# Altium schematic sheet VINYL-Player.SchDoc
size 297 x 209 mm
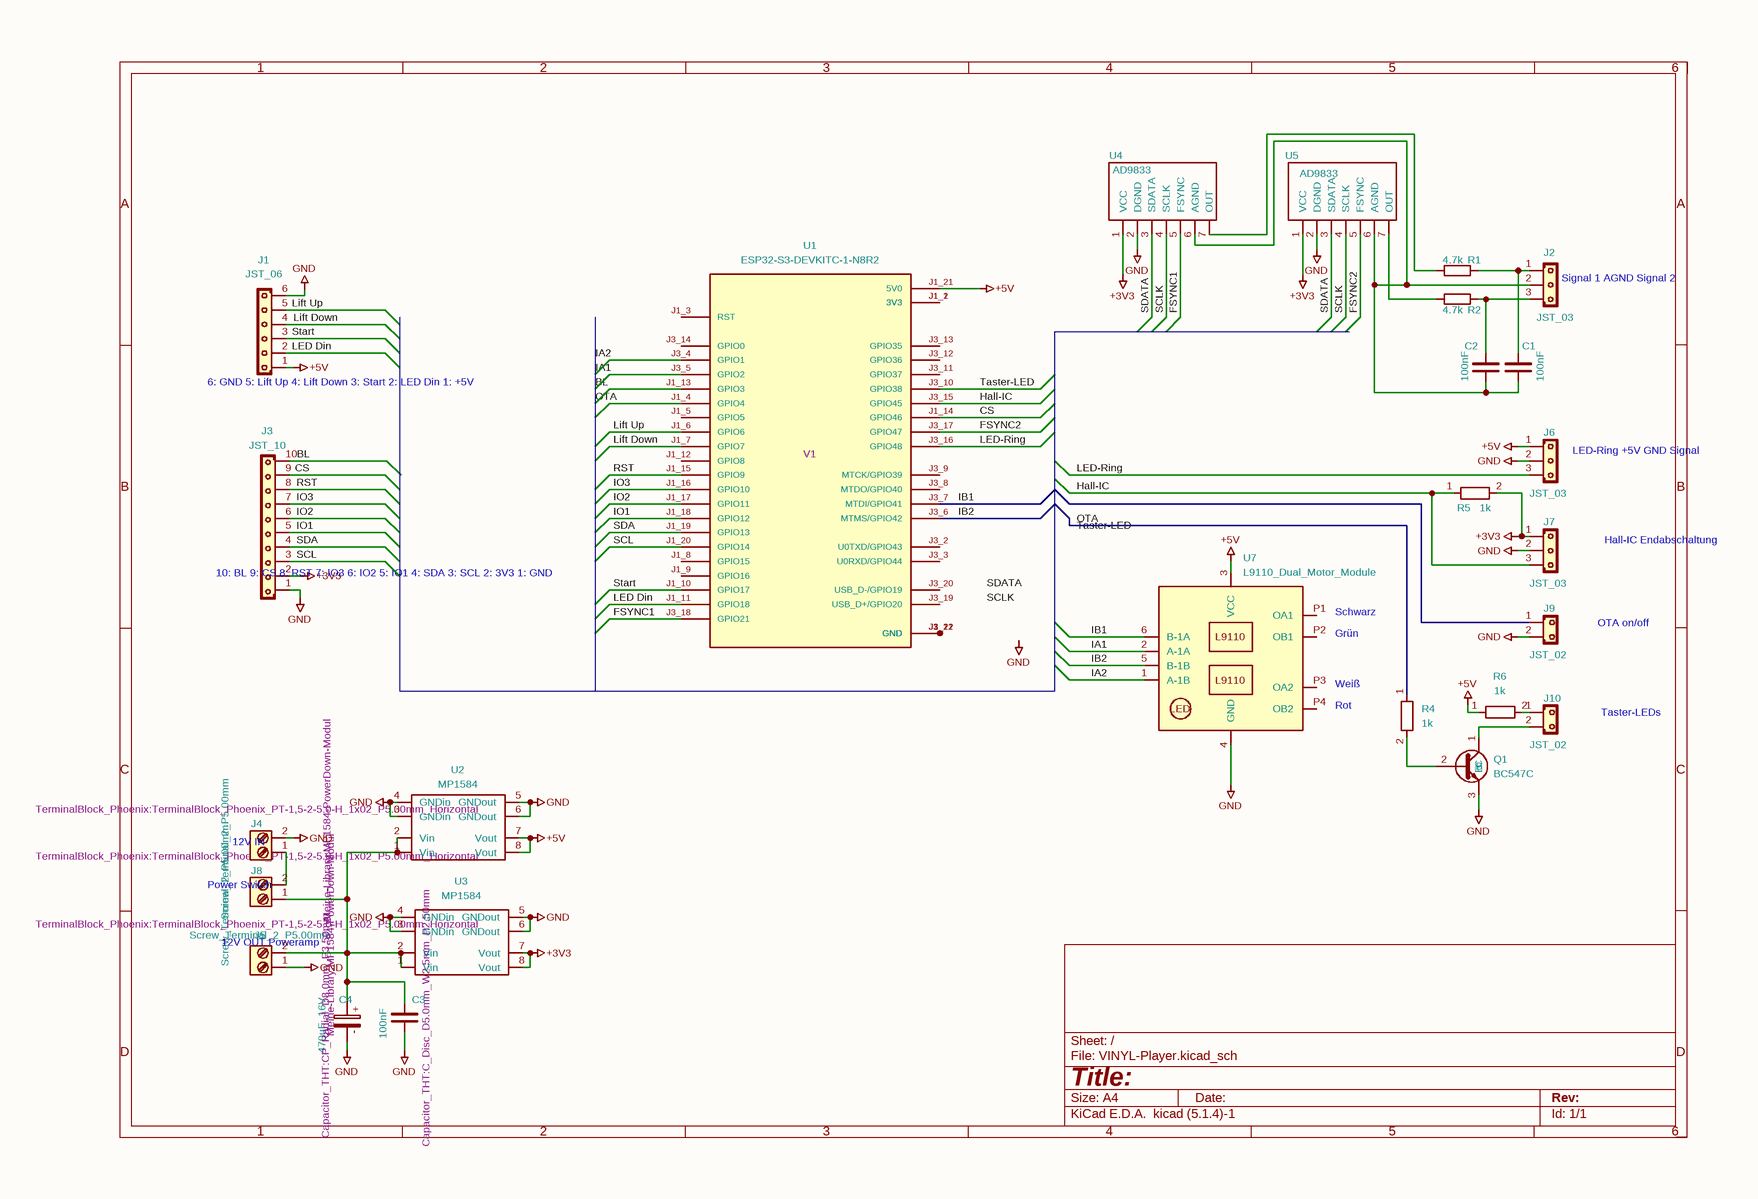
[diagram p0: VINYL-Player.SchDoc]

## Parts
C1  100nF  [C_Disc_D5.0mm_W2.5mm_P2.50mm]
C2  100nF  [C_Disc_D5.0mm_W2.5mm_P2.50mm]
C3  Footprint: Capacitor_THT:C_Disc_D5.0mm_W2.5mm_P2.50mm  [C_Disc_D5.0mm_W2.5mm_P2.50mm]  (hidden comment: 100nF)
C4  Footprint: Capacitor_THT:CP_Radial_D8.0mm_P3.50mm  [CP_Radial_D8.0mm_P3.50mm]  (hidden comment: 470uF_16V)
J1  JST_06  [JST_EH_B6B-EH-A_1x06_P2.50mm_Vertical]
J2  JST_03  [JST_EH_B3B-EH-A_1x03_P2.50mm_Vertical]
J3  JST_10  [JST_EH_B10B-EH-A_1x10_P2.50mm_Vertical]
J4  Footprint: TerminalBlock_Phoenix:TerminalBlock_Phoenix_PT-1,5-2-5.0-H_1x02_P5.00mm_Horizontal  [TerminalBlock_Phoenix_PT-1,5-2-5.0-H_1x02_P5.00mm_Horizontal]  (hidden comment: Screw_Terminal_2_P5.00mm)
J5  Footprint: TerminalBlock_Phoenix:TerminalBlock_Phoenix_PT-1,5-2-5.0-H_1x02_P5.00mm_Horizontal  [TerminalBlock_Phoenix_PT-1,5-2-5.0-H_1x02_P5.00mm_Horizontal]  (hidden comment: Screw_Terminal_2_P5.00mm)
J6  JST_03  [JST_EH_B3B-EH-A_1x03_P2.50mm_Vertical]
J7  JST_03  [JST_EH_B3B-EH-A_1x03_P2.50mm_Vertical]
J8  Footprint: TerminalBlock_Phoenix:TerminalBlock_Phoenix_PT-1,5-2-5.0-H_1x02_P5.00mm_Horizontal  [TerminalBlock_Phoenix_PT-1,5-2-5.0-H_1x02_P5.00mm_Horizontal]  (hidden comment: Screw_Terminal_2_P5.00mm)
J9  JST_02  [JST_EH_B2B-EH-A_1x02_P2.50mm_Vertical]
J10  JST_02  [JST_EH_B2B-EH-A_1x02_P2.50mm_Vertical]
Q1  BC547C  [TO-92_Inline_Wide_CBE]
R1  4.7k  [R_Axial_DIN0207_L6.3mm_D2.5mm_P10.16mm_Horizontal]
R2  4.7k  [R_Axial_DIN0207_L6.3mm_D2.5mm_P10.16mm_Horizontal]
R4  1k  [R_Axial_DIN0204_L3.6mm_D1.6mm_P7.62mm_Horizontal]
R5  1k  [R_Axial_DIN0204_L3.6mm_D1.6mm_P7.62mm_Horizontal]
R6  1k  [R_Axial_DIN0204_L3.6mm_D1.6mm_P7.62mm_Horizontal]
U1  PARTREV: V1  [XCVR_ESP32-S3-DEVKITC-1-N8R2]  (hidden comment: ESP32-S3-DEVKITC-1-N8R2)
U2  Footprint: Meine-Library:MP1584-PowerDown-Modul  [MP1584-PowerDown-Modul]  (hidden comment: MP1584)
U3  Footprint: Meine-Library:MP1584-PowerDown-Modul  [MP1584-PowerDown-Modul]  (hidden comment: MP1584)
U4  AD9833  [AD9833-Modul-Hochkant]
U5  AD9833  [AD9833-Modul-Hochkant]
U7  L9110_Dual_Motor_Module  [L9110_Dual_Motor_Module]

## Nets
+3V3: J3.2 J7.1 R5.2 U3.7(Vout) U3.8(Vout) U4.1(VCC) U5.1(VCC)
+5V: J1.1 J6.1 R6.1 U1.J1_21(5V0) U2.7(Vout) U2.8(Vout) U7.3(VCC)
GND: C3.1 C4.2 J1.6 J3.1 J4.2 J5.1 J6.2 J7.2 J9.2 Q1.3(E) U2.3(GNDin) U2.4(GNDin) U2.5(GNDout) U2.6(GNDout) U3.3(GNDin) U3.4(GNDin) U3.5(GNDout) U3.6(GNDout) U4.2(DGND) U5.2(DGND) U7.4(GND)
BL: J3.10 U1.J3_5(GPIO2)
CS: J3.9 U1.J1_14(GPIO46)
FSYNC1: U1.J3_18(GPIO21) U4.5(FSYNC)
FSYNC2: U1.J3_17(GPIO47) U5.5(FSYNC)
Hall-IC: J7.3 R5.1 U1.J3_15(GPIO45)
IA1: U1.J3_4(GPIO1) U7.2(A-1A)
IA2: U7.1(A-1B)
IB1: U1.J3_7(MTDI/GPIO41) U7.6(B-1A)
IB2: U1.J3_6(MTMS/GPIO42) U7.5(B-1B)
IO1: J3.5 U1.J1_18(GPIO12)
IO2: J3.6 U1.J1_17(GPIO11)
IO3: J3.7 U1.J1_16(GPIO10)
LED Din: J1.2 U1.J1_11(GPIO18)
LED-Ring: J6.3 U1.J3_16(GPIO48)
Lift Down: J1.4 U1.J1_7(GPIO7)
Lift Up: J1.5 U1.J1_6(GPIO6)
OTA: R4.1 U1.J1_13(GPIO3)
RST: J3.8 U1.J1_15(GPIO9)
SCL: J3.3 U1.J1_20(GPIO14)
SCLK: U4.4(SCLK) U5.4(SCLK)
SDA: J3.4 U1.J1_19(GPIO13)
SDATA: U4.3(SDATA) U5.3(SDATA)
Start: J1.3 U1.J1_10(GPIO17)
Taster-LED: U1.J3_10(GPIO38)
NetC1_1: C1.1 C2.1 J2.2 U4.6(AGND) U5.6(AGND)
NetC1_2: C1.2 J2.1 R1.2
NetC2_2: C2.2 J2.3 R2.1
NetC3_2: C3.2 C4.1 J5.2 J8.1 U2.1(Vin) U2.2(Vin) U3.1(Vin) U3.2(Vin)
NetJ4_1: J4.1 J8.2
NetJ10_1: J10.1 R6.2
NetJ10_2: J10.2 Q1.1(C)
NetQ1_2: Q1.2(B) R4.2
NetR1_1: R1.1 U4.7(OUT)
NetR2_2: R2.2 U5.7(OUT)
NetU1_J1_1: U1.J1_1(3V3) U1.J1_2(3V3)
NetU1_J1_22: U1.J1_22(GND) U1.J3_1(GND) U1.J3_21(GND) U1.J3_22(GND)

Not connected (* = marked no-connect by the designer): J9 1; U1 J1_3(RST) J1_4(GPIO4) J1_5(GPIO5) J1_8(GPIO15) J1_9(GPIO16) J1_12(GPIO8) J3_2(U0TXD/GPIO43) J3_3(U0RXD/GPIO44) J3_8(MTDO/GPIO40) J3_9(MTCK/GPIO39) J3_11(GPIO37) J3_12(GPIO36) J3_13(GPIO35) J3_14(GPIO0) J3_19(USB_D+/GPIO20) J3_20(USB_D-/GPIO19); U7 P1(OA1) P2(OB1) P3(OA2) P4(OB2)

## Buses and harness runs
bus IA2

## Notes on the sheet
- (near J2) Signal 1
  AGND
  Signal 2
- (near J1) 6: GND
  5: Lift Up
  4: Lift Down
  3: Start
  2: LED Din
  1: +5V
- (near J6) LED-Ring
  +5V
  GND
  Signal
- (near J3) 10: BL
  9: CS
  8: RST
  7: IO3
  6: IO2
  5: IO1
  4: SDA
  3: SCL
  2: 3V3
  1: GND
- Hall-IC
  Endabschaltung
- (near U7) Schwarz
- (near U7) Grün
- OTA on/off
- (near U7) Rot
- Weiß
- Taster-LEDs
- (near J4) 12V
  IN
- (near J8) Power Switch
- (near J5) 12V
  OUT
  Poweramp
- Labels drawn without touching a wire or pin: GND, SCLK, SDATA, Taster-LED
- 1
- 2
- 3
- 4
- 5
- 6
- A
- B
- C
- D
- Title:
- File: VINYL-Player.kicad_sch
- Sheet: /
- KiCad E.D.A.  kicad (5.1.4)-1
- Size: A4
- Date:
- Rev:
- Id: 1/1
- (in symbol 470uF_16V) +; -
- (in symbol L9110_Dual_Motor_Module) L9110; LED

## Library data of the parts
C1-C3 = 100nF_Ceramic: Value: 100nF
  C1 C2: Footprint: Capacitor_THT:C_Disc_D5.0mm_W2.5mm_P2.50mm
R4-R6 = R_DIN0204_P7.62mm: Value: 1k; Footprint: PCM_Resistor_THT_AKL:R_Axial_DIN0204_L3.6mm_D1.6mm_P7.62mm_Horizontal
U1 = ESP32-S3-DEVKITC-1-N8R2: MANUFACTURER: Espressif; MF: Espressif Systems; Description_1: WiFi Development Tools - 802.11 ESP32-S3 general-purpose development board, embeds ESP32-S3-WROOM-1-N8R2, with pin header; Package: None; Price: None; Check_prices: https://www.snapeda.com/parts/ESP32-S3-DEVKITC-1-N8R2/Espressif+Systems/view-part/?ref=eda; STANDARD: Manufacturer Recommendations; SnapEDA_Link: https://www.snapeda.com/parts/ESP32-S3-DEVKITC-1-N8R2/Espressif+Systems/view-part/?ref=snap; MP: ESP32-S3-DEVKITC-1-N8R2; Availability: In Stock; Value: ESP32-S3-DEVKITC-1-N8R2; Footprint: Meine-Library:XCVR_ESP32-S3-DEVKITC-1-N8R2
U2 U3 = MP1584-PowerDown-Modul: Value: MP1584
U4 U5 = AD9833-Modul: Value: AD9833; Footprint: Meine-Library:AD9833-Modul-Hochkant
C4 = 470uF_16V: Value: 470uF_16V
J1 = JST_06: Value: JST_06; Footprint: Connector_JST:JST_EH_B6B-EH-A_1x06_P2.50mm_Vertical
J2 J6 J7 = JST_03: Value: JST_03; Footprint: Connector_JST:JST_EH_B3B-EH-A_1x03_P2.50mm_Vertical
J3 = JST_10: Value: JST_10; Footprint: Connector_JST:JST_EH_B10B-EH-A_1x10_P2.50mm_Vertical
J4 J5 J8 = Screw_Terminal_2_P5.00mm: Value: Screw_Terminal_2_P5.00mm
J9 J10 = JST_02: Value: JST_02; Footprint: Connector_JST:JST_EH_B2B-EH-A_1x02_P2.50mm_Vertical
Q1 = BC547C: Value: BC547C; Footprint: PCM_Package_TO_SOT_THT_AKL:TO-92_Inline_Wide_CBE
R1 R2 = 4.7k: Value: 4.7k; Footprint: Resistor_THT:R_Axial_DIN0207_L6.3mm_D2.5mm_P10.16mm_Horizontal
U7 = L9110_Dual_Motor_Module: Value: L9110_Dual_Motor_Module; Footprint: Meine-Library:L9110_Dual_Motor_Module